# Altium schematic sheet Powersupply.SchDoc: 3.3VDC Powersupply
size A4; Date: 2017-08-24; DocumentNumber: 9; Revision: C; SheetNumber: 9; SheetTotal: 16; DesignedBy: Craig Comberbach
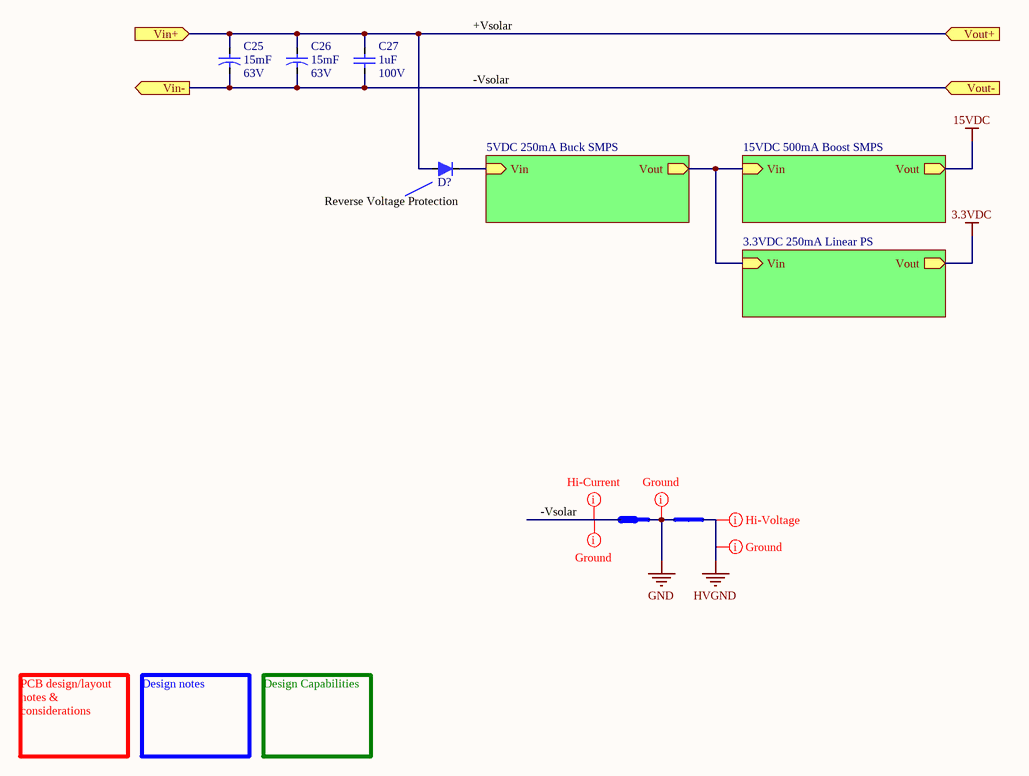
[diagram p0: Powersupply.SchDoc]

## Parts
C25  Capacitance: 15mF  Voltage: 63V  (hidden comment: 15mF Radial 63V)
C26  Capacitance: 15mF  Voltage: 63V  (hidden comment: 15mF Radial 63V)
C27  Voltage - Rated: 100V  Capacitiance: 1uF  (hidden comment: 1uF 1206 100V)
D?  Diode - Signal 1A  (value not drawn)
NetTie2  Net Tie - Same Size  (value not drawn)  (net tie, no BOM)
NetTie10  Net Tie - Different Sizes  (value not drawn)  (net tie, no BOM)

## Sub-sheets
3.3VDC 250mA Linear PS = 3.3VDC 250mA Linear PS.SchDoc: Vin (in), Vout (out)
5VDC 250mA Buck SMPS = 5VDC 250mA Buck SMPS.SchDoc: Vin (in), Vout (out)
15VDC 500mA Boost SMPS = 15VDC 500mA Boost SMPS.SchDoc: Vin (in), Vout (out)

## Ports
Vin+ (in), Vin- (out), Vout+ (in), Vout- (in)

## Nets
3.3VDC: sheet 3.3VDC 250mA Linear PS/Vout
15VDC: sheet 15VDC 500mA Boost SMPS/Vout
GND: NetTie2.2 NetTie10.1
HVGND: NetTie2.1
+Vsolar: C25.1 C26.1 C27.1 D?.1(Anode) ; port Vin+, port Vout+
-Vsolar: C25.2 C26.2 C27.2 NetTie10.2 ; port Vin-, port Vout-
NetD?_2: D?.2(Cathode) ; sheet 5VDC 250mA Buck SMPS/Vin
(unnamed): sheet 15VDC 500mA Boost SMPS/Vin, sheet 3.3VDC 250mA Linear PS/Vin, sheet 5VDC 250mA Buck SMPS/Vout

## Layout directives
net class 15A: -Vsolar
net class 171-250V: HVGND
net class Grounds: -Vsolar, GND, HVGND

## Notes on the sheet
- (near D?) Reverse Voltage Protection
- PCB design/layout notes & considerations
- Design notes
- Design Capabilities
- Repository Version
- BOM/Variant

## Library data of the parts
C25 C26 = 15mF Radial 63V: Polarized; Manufacturer: United Chemi-Con; Manufacturer Part Number: EKMH630VSN153MA63T; Tolerance: ±20%; ESR (Equivalent Series Resistance): 14 mOhm @ 120Hz; Lifetime @ Temp.: 2000 Hrs @ 105°C; Polarization: Polar; Ripple Current - Low Frequency: 4.88A @ 120Hz; Ripple Current - High Frequency: 5.856A @ 100kHz; Value: 15mF Radial 63V; Supplier 1: Digi-Key; RoHS: RoHS Compliant; Category: Capacitors; Stock 1: 194; Pricing 1: 1=7.02, 10=6.237, 100=4.9896, 500=4.28794, 1000=4.0392 (USD); Packaging: Bulk; Part Status: Active; Operating Temperature: -40°C ~ 105°C; Applications: General Purpose; Lead Spacing: 0.394" (10.00mm); Size / Dimension: 1.378" Dia (35.00mm); Height - Seated (Max): 2.559" (65.00mm); Surface Mount Land Size: -; Mounting Type: Through Hole; Package / Case: Radial, Can - Snap-In; ComponentLink1URL: http://www.chemi-con.co.jp/cgi-bin/CAT_DB/SEARCH/cat_db_al.cgi?e=e&j=p&pdfname=kmhlug; ComponentLink1Description: Spec Sheet; Supplier Part Number 1: 565-4208-ND
C27 = 1uF 1206 100V: Non-polarized; Manufacturer: Samsung Electro-Mechanics America, Inc.; Manufacturer Part Number: CL31B105KCHNNNE; Tolerance: ±10%; Temperature Coefficient: X7R; Value: 1uF 1206 100V; Supplier 1: Digi-Key; RoHS: RoHS Compliant; Category: Capacitors; Stock 1: 479067; Pricing 1: 1=0.32, 10=0.221, 100=0.1326, 500=0.09942, 1000=0.08396 (USD); Packaging: Cut Tape (CT); Part Status: Active; Operating Temperature: -55°C ~ 125°C; Features: -; Ratings: -; Applications: General Purpose; Mounting Type: Surface Mount, MLCC; Package / Case: 1206 (3216 Metric); Size / Dimension: 0.126" L x 0.063" W (3.20mm x 1.60mm); Height - Seated (Max): -; Thickness (Max): 0.071" (1.80mm); Lead Spacing: -; Lead Style: -; ComponentLink1URL: http://media.digikey.com/pdf/Data%20Sheets/Samsung%20PDFs/CL_Series_MLCC_ds.pdf; ComponentLink1Description: Spec Sheet; Supplier Part Number 1: 1276-1838-1-ND
D? = Diode - Signal 1A: Signal Diode; Manufacturer: Vishay Semiconductor Diodes Division; Manufacturer Part Number: US1G-E3/5AT; Diode Type: Standard; Voltage - DC Reverse (Vr) (Max): 400V; Voltage - Forward (Vf) (Max) @ If: 1V @ 1A; Speed: Fast Recovery =< 500ns, > 200mA (Io); Reverse Recovery Time (trr): 50ns; Current - Reverse Leakage @ Vr: 10µA @ 400V; Capacitance @ Vr, F: 15pF @ 4V, 1MHz; Supplier 1: Digi-Key; Supplier Part Number 1: US1G-E3/5ATGICT-ND; RoHS: RoHS Compliant; Category: Discrete Semiconductor Products; Stock 1: 29002; Pricing 1: 1=0.41, 10=0.312, 25=0.2816, 100=0.1945, 250=0.1638, 500=0.1331, 1000=0.10238, 2500=0.09214 (USD); Packaging: Cut Tape (CT); Part Status: Active; Current - Average Rectified (Io): 1A; Mounting Type: Surface Mount; Package / Case: DO-214AC, SMA; Supplier Device Package: DO-214AC (SMA); Operating Temperature - Junction: -55°C ~ 150°C; ComponentLink1URL: http://www.vishay.com/docs/88768/us1.pdf; ComponentLink1Description: Spec Sheet
NetTie2 = Net Tie - Same Size: Ties two nets together
NetTie10 = Net Tie - Different Sizes: Ties two nets together